# Altium schematic sheet LM7805FixedReg.SchDoc: 5V Linear Regulator
size A; DrawnBy: LSG; SheetNumber: 2; SheetTotal: 3
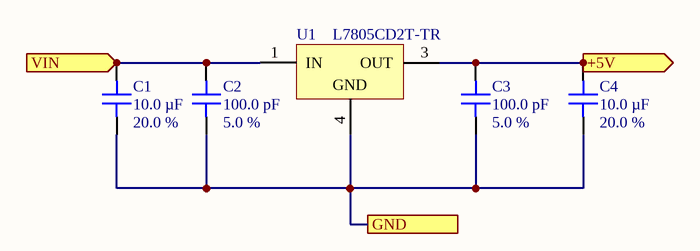
[diagram p0: LM7805FixedReg.SchDoc]

## Parts
C1  10.0 µF  Tolerance: 20.0 %  [PCB - CAPACITOR - MLCC - CAP 0603_1608]
C2  100.0 pF  Tolerance: 5.0 %  [PCB - CAPACITOR - MLCC - CAP 0603_1608]
C3  100.0 pF  Tolerance: 5.0 %  [PCB - CAPACITOR - MLCC - CAP 0603_1608]
C4  10.0 µF  Tolerance: 20.0 %  [PCB - CAPACITOR - MLCC - CAP 0603_1608]
U1  L7805CD2T-TR  [TO-263_M]

## Ports
+5V (out), GND, VIN (in)

## Nets
+5V: C3.2 C4.2 U1.3(OUT) ; port +5V
GND: C1.1 C2.1 C3.1 C4.1 U1.4(GND) ; port GND
VIN: C1.2 C2.2 U1.1(IN) ; port VIN

## Library data of the parts
C1 C4 = 1572: 10 µF ±20% 16V Ceramic Capacitor X5R 0603 (1608 Metric); Rowan Part Number: 1572; Manufacturer: YAGEO; Manufacturer part number: CC0603MRX5R7BB106; Name: 10.0 µF 16.0 V 20.0 % Ceramic Capacitor; Voltage Rating: 16.0 V; Supplier 1: Digi-Key; Supplier Part Number 1: 311-1822-2-ND; Category: Capacitors; Datasheet: https://www.yageo.com/upload/media/product/productsearch/datasheet/mlcc/UPY-GPHC_X5R_4V-to-50V_26.pdf; Status: Active; Package: 0603 (1608 Metric); Packaging: Tape & Reel (TR); Composition: Ceramic; Capacitance: 10.0 µF
C2 C3 = 1535: 100 pF ±5% 50V Ceramic Capacitor X7R 0603 (1608 Metric); Rowan Part Number: 1535; Manufacturer: YAGEO; Manufacturer part number: CC0603JRX7R9BB101; Name: 100.0 pF 50.0 V 5.0 % Ceramic Capacitor; Voltage Rating: 50.0 V; Supplier 1: Digi-Key; Supplier Part Number 1: 311-4003-2-ND; Category: Capacitors; Datasheet: https://www.yageo.com/upload/media/product/productsearch/datasheet/mlcc/UPY-GPHC_X7R_6.3V-to-50V_20.pdf; Status: Active; Package: 0603 (1608 Metric); Packaging: Tape & Reel (TR); Composition: Ceramic; Capacitance: 100.0 pF
U1 = CMP-0244-00213-1: Positive Voltage Regulator, 3-Pin D2PAK, Tape and Reel; PackageReference: TO-263; ComponentLink2URL: http://www.st.com/internet/com/TECHNICAL_RESOURCES/TECHNICAL_LITERATURE/DATASHEET/CD00000444.pdf; PackageDescription: 3-Pin Transistor Outline Package 2.54 mm Pitch, 15.4 mm Lead Span (D2PAK); DatasheetVersion: 16/11/2011; ComponentLink2Description: Datasheet; ComponentLink1Description: Manufacturer URL; PackageVersion: 2011; ComponentLink1URL: http://www.st.com